# EAGLE schematic blaster (EAGLE 6.2)
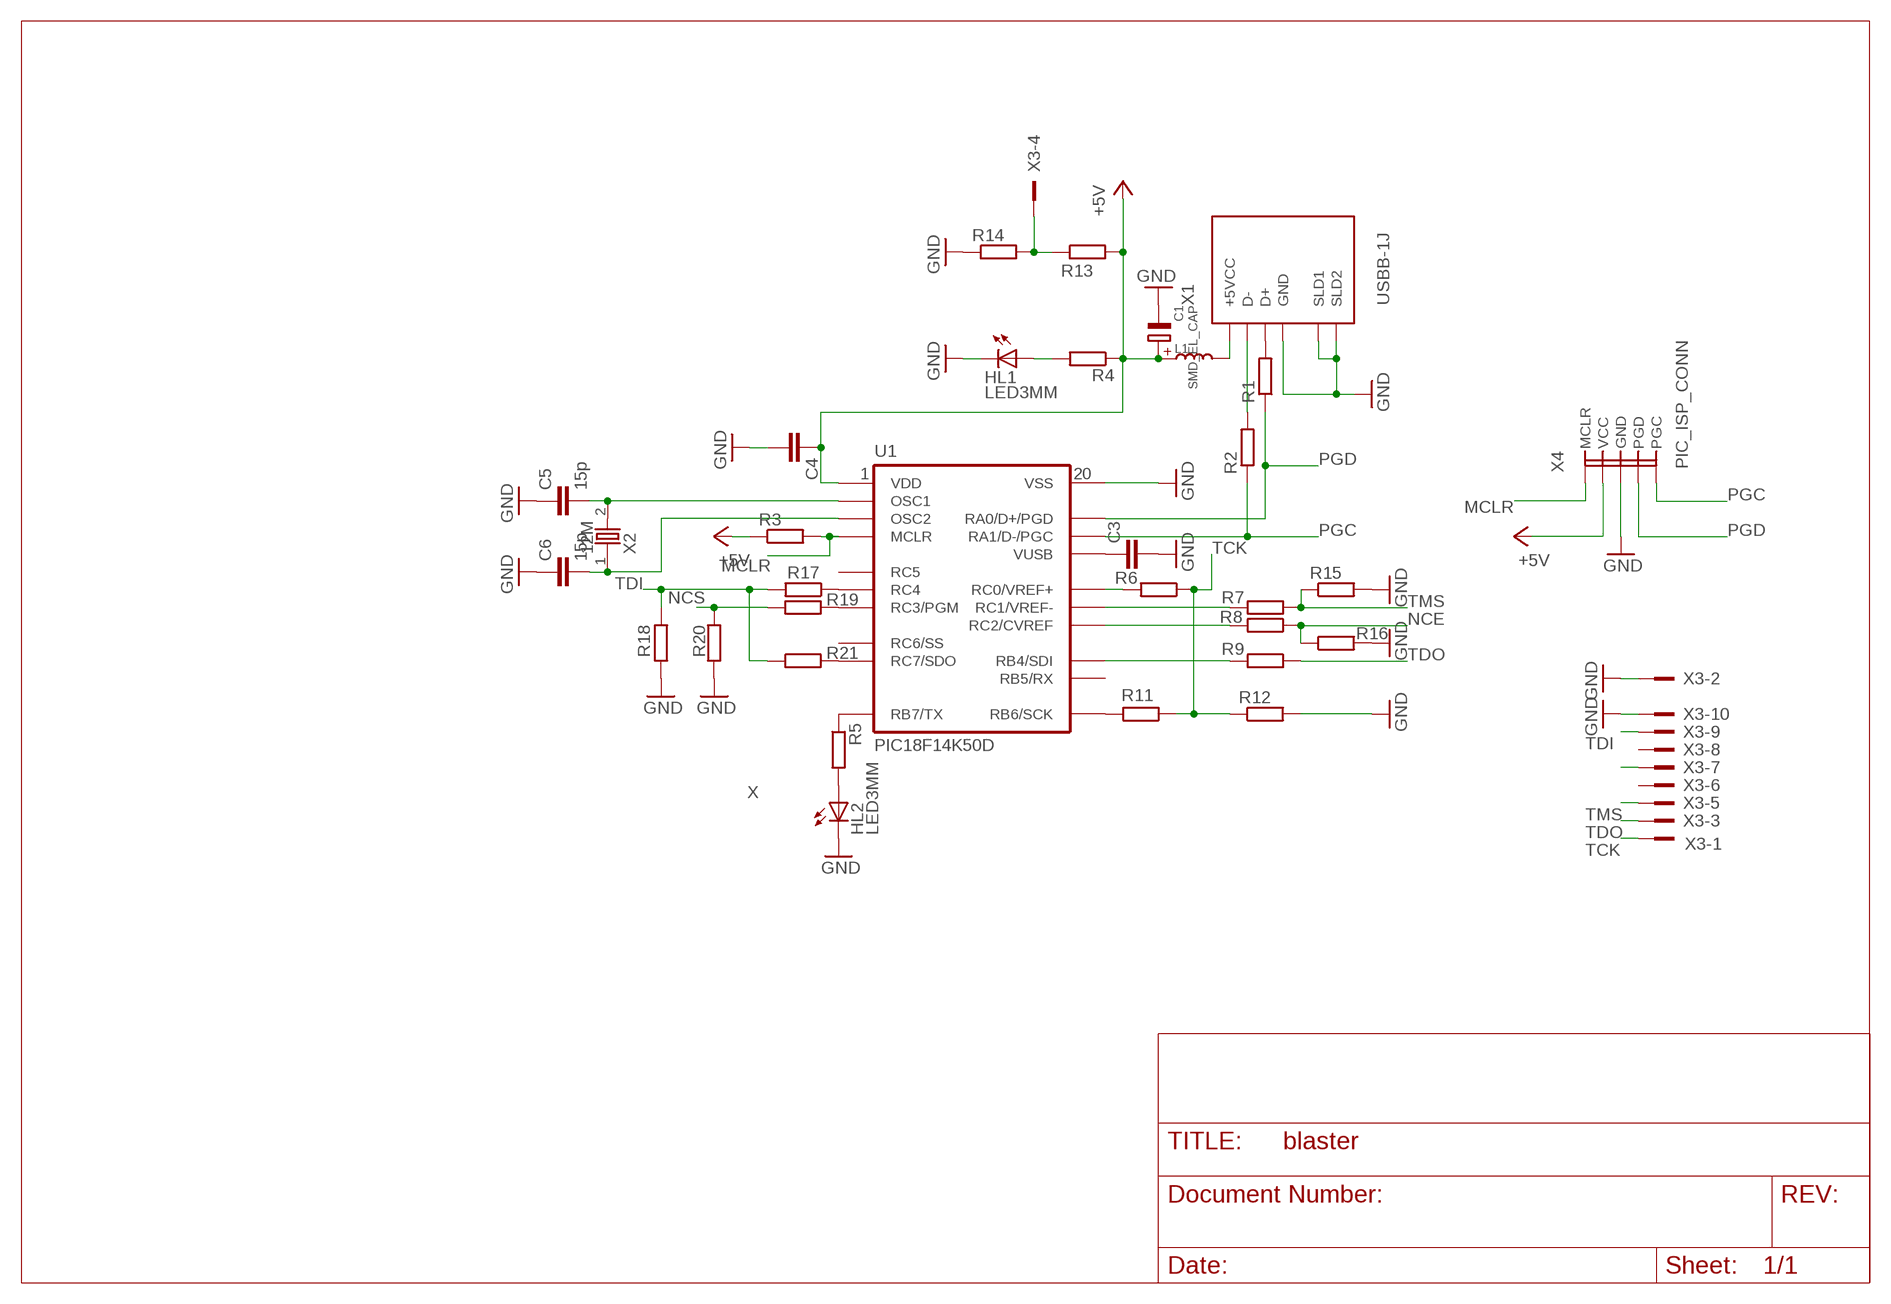
[diagram p0: schematic, sheet 1]

## Parts
C1  SMD_EL_CAP  [153CLV-0405]
C3  SMD_CAPC1206K  [C1206K]
C4  SMD_CAPC1206K  [C1206K]
C5  15p  C0805  [C0805D]
C6  15p  C0805  [C0805D]
HL1  LED3MM  [LED3MM]
HL2  LED3MM  [LED3MM]
L1  INDUCTORIND2  [INDUCTOR2]
R1  SMD_RES  [R1206]
R2  SMD_RES  [R1206]
R3  10k  SMD_RES  [R1206]
R4  1k  SMD_RES  [R1206]
R5  1k  SMD_RES  [R1206]
R6  100  SMD_RES  [R1206]
R7  100  SMD_RES  [R1206]
R8  100  SMD_RES  [R1206]
R9  100  SMD_RES  [R1206]
R11  100  SMD_RES  [R1206]
R12  200  SMD_RES  [R1206]
R13  100  SMD_RES  [R1206]
R14  200  SMD_RES  [R1206]
R15  200  SMD_RES  [R1206]
R16  200  SMD_RES  [R1206]
R17  100  SMD_RES  [R1206]
R18  200  SMD_RES  [R1206]
R19  100  SMD_RES  [R1206]
R20  200  SMD_RES  [R1206]
R21  100  SMD_RES  [R1206]
U1  PIC18F14K50D  [SO20-DW]
X1  USBB-1J  [USBB-1J]
X2  12М  HC49/S  [HC49/S]
X3  X  DC-10_CON5  [PAK100/2500-5-10]
X4  PIC_ISP_CONN  [PLC-5PIN]

## Nets
+5V: C1.+ C4.1 L1.P$1 R3.1 R4.1 R13.2 U1.1.1(VDD) X4.P$2(VCC)
GND: C1.- C3.2 C4.2 C5.1 C6.1 HL1.K(C) HL2.K(C) R12.2 R14.1 R15.2 R16.2 R18.1 R20.1 U1.1.20(VSS) X1.4(GND) X1.5(SLD1) X1.6(SLD2) X3.2 X3.10 X4.P$3(GND)
MCLR: R3.2 U1.1.4(MCLR) X4.P$1(MCLR)
N$2: R1.2 X1.3(D+)
N$3: L1.P$2 X1.1(+5VCC)
N$4: R2.2 X1.2(D-)
N$5: C3.1 U1.1.17(VUSB)
N$6: HL1.A R4.2
N$7: R5.1 U1.1.10(RB7/TX)
N$8: C5.2 U1.1.2(OSC1) X2.2
N$9: C6.2 U1.1.3(OSC2) X2.1
N$10: HL2.A R5.2
N$12: R6.2 U1.1.16(RC0/VREF+)
N$13: R17.1 U1.1.6(RC4)
N$14: R7.2 U1.1.15(RC1/VREF-)
N$15: R8.2 U1.1.14(RC2/CVREF)
N$16: R9.2 U1.1.13(RB4/SDI)
N$18: R11.2 U1.1.11(RB6/SCK)
N$19: R19.2 U1.1.7(RC3/PGM)
N$20: R21.2 U1.1.9(RC7/SDO)
N$22: X3.7
NCE: R8.1 R16.1
NCS: R19.1 R20.2
PGC: R2.1 U1.1.18(RA1/D-/PGC) X4.P$5(PGC)
PGD: R1.1 U1.1.19(RA0/D+/PGD) X4.P$4(PGD)
TCK: R6.1 R11.1 R12.1 X3.1
TDI: R17.2 R18.2 R21.1 X3.9
TDO: R9.1 X3.3
TMS: R7.1 R15.1 X3.5
VCC_3.3: R13.1 R14.2 X3.4
Unconnected: U1.1.5(RC5) U1.1.8(RC6/SS) U1.1.12(RB5/RX) X3.6 X3.8

## Library data of the parts
C1 = Dmitry:SMD_EL_CAP
C3 C4 = Dmitry:SMD_CAP: CAPACITOR, European symbol
C5 C6 = den:C0805
HL1 HL2 = den:LED3MM
L1 = Dmitry:INDUCTOR
R1-R9 R11-R21 = Dmitry:SMD_RES
U1 = Dmitry:PIC18F14K50: L6205* DMOS DUAL FULL BRIDGE DRIVER Cases: L6205N (PowerDIP20), L6205D (PowerSO20) Author: Dipl.-Ing. FH Rainer Bayer, rainer.bayer@hs-heilbronn.de, www.ing-rb.de/hhn Notes: 1. ENA, ENB pin direction "I/O": see data sheet (ENA and ENB pins open collector driving vs. push-pull driving) 2. SENSEA, SENSEB pin direction "PWR": see data sheet (power ground)
X1 = den:USBB-1J
X2 = den:HC49/S
X3 = Dmitry:DC-10_CON: 3M (TM) Pak 100 4-Wall Header Source: 3M; OC_FARNELL: 1788669; OC_NEWARK: unknown
X4 = den:PIC_ISP_CONN